# Altium schematic sheet Connectors.SchDoc
size A4; SheetNumber: 13; SheetTotal: 21
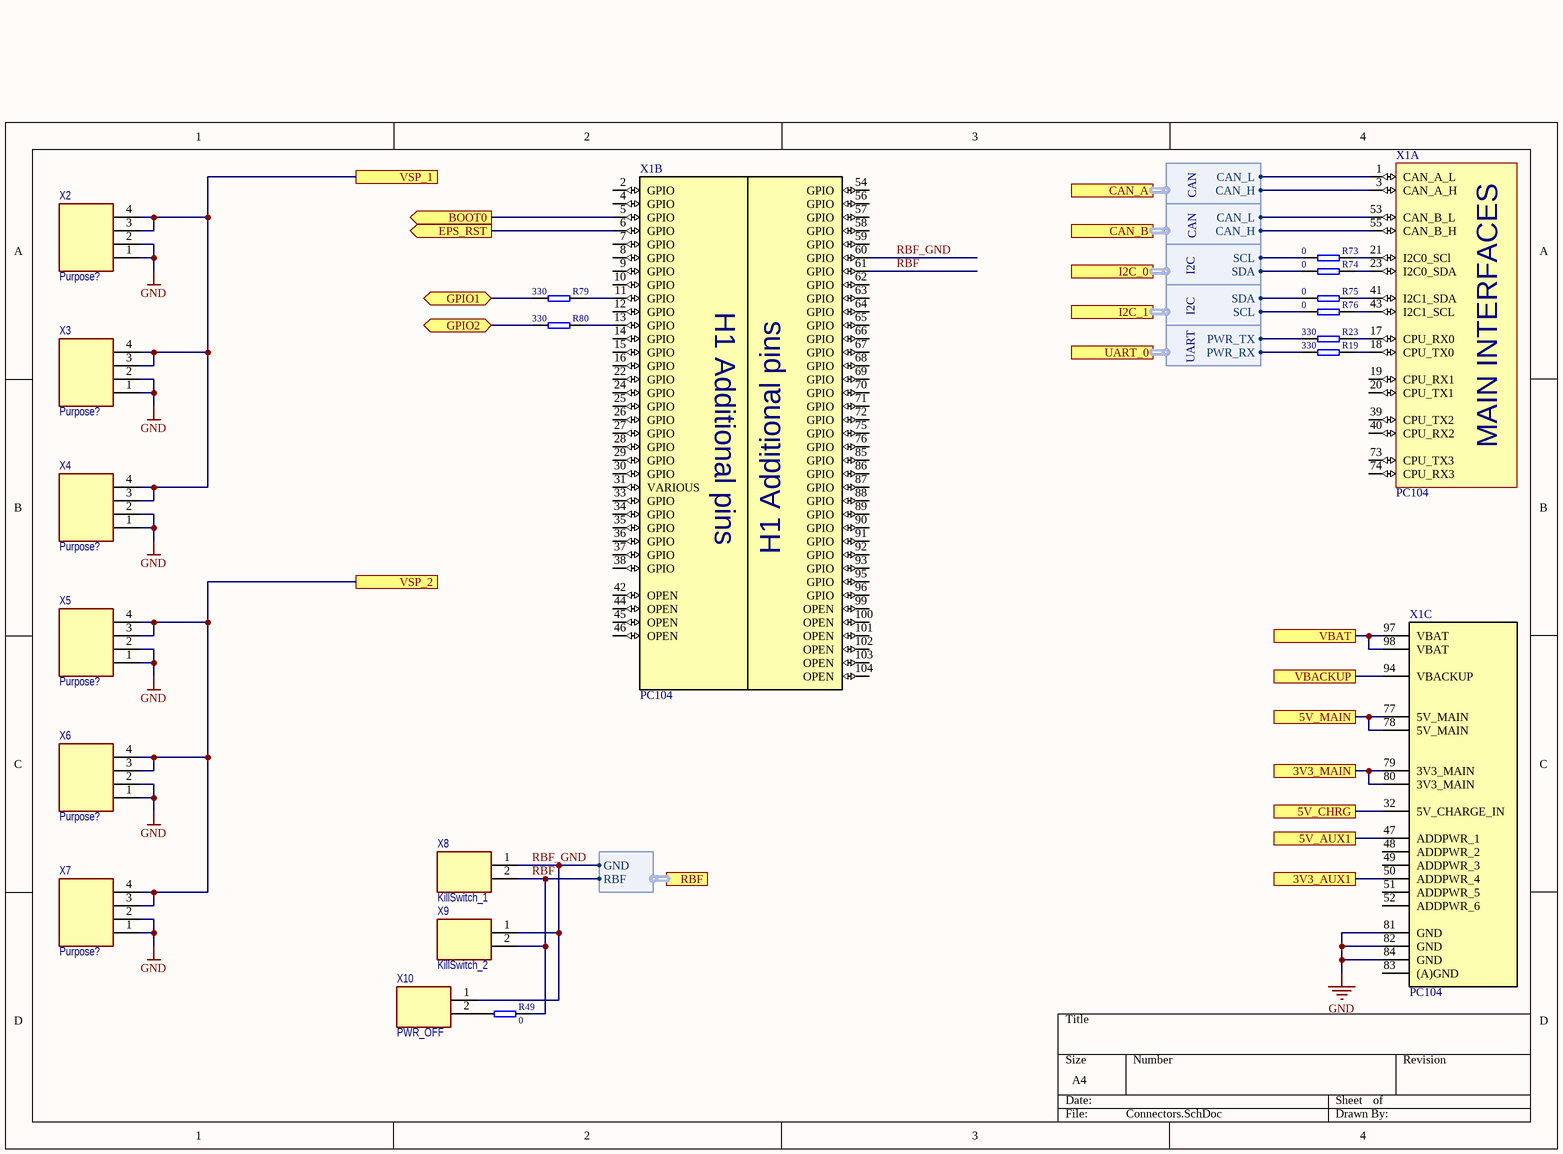
[diagram p0: Connectors.SchDoc]

## Parts
R19  value 330  [RES 0402]
R23  value 330  [RES 0402]
R49  value 0  [RES 0402]
R73  value 0  [RES 0402]
R74  value 0  [RES 0402]
R75  value 0  [RES 0402]
R76  value 0  [RES 0402]
R79  value 330  [RES 0402]
R80  value 330  [RES 0402]
X1  PC104  [PC104_ArianSpace]  (parts A,B,C of 3)
X2  Purpose: Purpose?  [PicoBlade_4P]  (hidden comment: 0533980471)
X3  Purpose: Purpose?  [PicoBlade_4P]  (hidden comment: 0533980471)
X4  Purpose: Purpose?  [PicoBlade_4P]  (hidden comment: 0533980471)
X5  Purpose: Purpose?  [PicoBlade_4P]  (hidden comment: 0533980471)
X6  Purpose: Purpose?  [PicoBlade_4P]  (hidden comment: 0533980471)
X7  Purpose: Purpose?  [PicoBlade_4P]  (hidden comment: 0533980471)
X8  Purpose: KillSwitch_1  [PicoBlade_2P]  (hidden comment: 0533980271)
X9  Purpose: KillSwitch_2  [PicoBlade_2P]  (hidden comment: 0533980271)
X10  Purpose: PWR_OFF  [PLS-2R-2.54]  (hidden comment: PLS-2R)

## Ports
3V3_AUX1, 3V3_MAIN, 5V_AUX1, 5V_CHRG, 5V_MAIN, BOOT0 (out), CAN_A (harness CAN), CAN_B (harness CAN), EPS_RST (out), GPIO1 (bidir), GPIO2 (bidir), I2C_0 (harness I2C), I2C_1 (harness I2C), RBF (harness RBF), UART_0 (harness UART), VBACKUP, VBAT, VSP_1, VSP_2

## Harnesses
CAN: CAN_H, CAN_L
I2C: SDA, SCL
UART: PWR_RX, PWR_TX
RBF: GND, RBF

## Nets
GND: X1.81(GND) X1.82(GND) X1.84(GND) X2.1 X2.2 X3.1 X3.2 X4.1 X4.2 X5.1 X5.2 X6.1 X6.2 X7.1 X7.2
3V3_AUX1: X1.50(ADDPWR_4) ; port 3V3_AUX1
3V3_MAIN: X1.79(3V3_MAIN) X1.80(3V3_MAIN) ; port 3V3_MAIN
5V_AUX1: X1.47(ADDPWR_1) ; port 5V_AUX1
5V_CHRG: X1.32(5V_CHARGE_IN) ; port 5V_CHRG
5V_MAIN: X1.77(5V_MAIN) X1.78(5V_MAIN) ; port 5V_MAIN
BOOT0: X1.5(GPIO) ; port BOOT0
EPS_RST: X1.6(GPIO) ; port EPS_RST
GPIO1: R79.1 ; port GPIO1
GPIO2: R80.1 ; port GPIO2
RBF: R49.2 X1.61(GPIO) X8.2 X9.2 ; port RBF.RBF
RBF_GND: X1.60(GPIO) X8.1 X9.1 X10.1 ; port RBF.GND
VBACKUP: X1.94(VBACKUP) ; port VBACKUP
VBAT: X1.97(VBAT) X1.98(VBAT) ; port VBAT
VSP_1: X2.3 X2.4 X3.3 X3.4 X4.3 X4.4 ; port VSP_1
VSP_2: X5.3 X5.4 X6.3 X6.4 X7.3 X7.4 ; port VSP_2
NetR19_1: R19.1 ; port UART_0.PWR_RX
NetR19_2: R19.2 X1.18(CPU_TX0)
NetR23_1: R23.1 ; port UART_0.PWR_TX
NetR23_2: R23.2 X1.17(CPU_RX0)
NetR49_1: R49.1 X10.2
NetR73_1: R73.1 ; port I2C_0.SCL
NetR73_2: R73.2 X1.21(I2C0_SCl)
NetR74_1: R74.1 ; port I2C_0.SDA
NetR74_2: R74.2 X1.23(I2C0_SDA)
NetR75_1: R75.1 ; port I2C_1.SDA
NetR75_2: R75.2 X1.41(I2C1_SDA)
NetR76_1: R76.1 ; port I2C_1.SCL
NetR76_2: R76.2 X1.43(I2C1_SCL)
NetR79_2: R79.2 X1.11(GPIO)
NetR80_2: R80.2 X1.13(GPIO)
NetX1_1: X1.1(CAN_A_L) ; port CAN_A.CAN_L
NetX1_3: X1.3(CAN_A_H) ; port CAN_A.CAN_H
NetX1_53: X1.53(CAN_B_L) ; port CAN_B.CAN_L
NetX1_55: X1.55(CAN_B_H) ; port CAN_B.CAN_H

Not connected (* = marked no-connect by the designer): X1 2(GPIO) 4(GPIO) 7(GPIO) 8(GPIO) 9(GPIO) 10(GPIO) 12(GPIO) 14(GPIO) 15(GPIO) 16(GPIO) 19(CPU_RX1) 20(CPU_TX1) 22(GPIO) 24(GPIO) 25(GPIO) 26(GPIO) 27(GPIO) 28(GPIO) 29(GPIO) 30(GPIO) 31(VARIOUS) 33(GPIO) 34(GPIO) 35(GPIO) 36(GPIO) 37(GPIO) 38(GPIO) 39(CPU_TX2) 40(CPU_RX2) 42(OPEN) 44(OPEN) 45(OPEN) 46(OPEN) 48(ADDPWR_2) 49(ADDPWR_3) 51(ADDPWR_5) 52(ADDPWR_6) 54(GPIO) 56(GPIO) 57(GPIO) 58(GPIO) 59(GPIO) 62(GPIO) 63(GPIO) 64(GPIO) 65(GPIO) 66(GPIO) 67(GPIO) 68(GPIO) 69(GPIO) 70(GPIO) 71(GPIO) 72(GPIO) 73(CPU_TX3) 74(CPU_RX3) 75(GPIO) 76(GPIO) 83((A)GND) 85(GPIO) 86(GPIO) 87(GPIO) 88(GPIO) 89(GPIO) 90(GPIO) 91(GPIO) 92(GPIO) 93(GPIO) 95(GPIO) 96(GPIO) 99(OPEN) 100(OPEN) 101(OPEN) 102(OPEN) 103(OPEN) 104(OPEN)

## Notes on the sheet
- (in symbol PC104_ArianSpace, part A) MAIN INTERFACES
- (in symbol PC104_ArianSpace, part B) H1 Additional pins

## Library data of the parts
R19 R23 R49 R73-R76 R79 R80 = !Resistor: Resistor; IsSMT: NoSMT
X1 = PC104_ArianSpace: PC104 connector
X2-X7 = Header 1x4: 4x1 header; IsSMT: NoSMT
X8-X10 = Header 1x2: 2x1 header; isSMT: NoSMT